# EAGLE design Board_V02 (EAGLE 9.3.0)
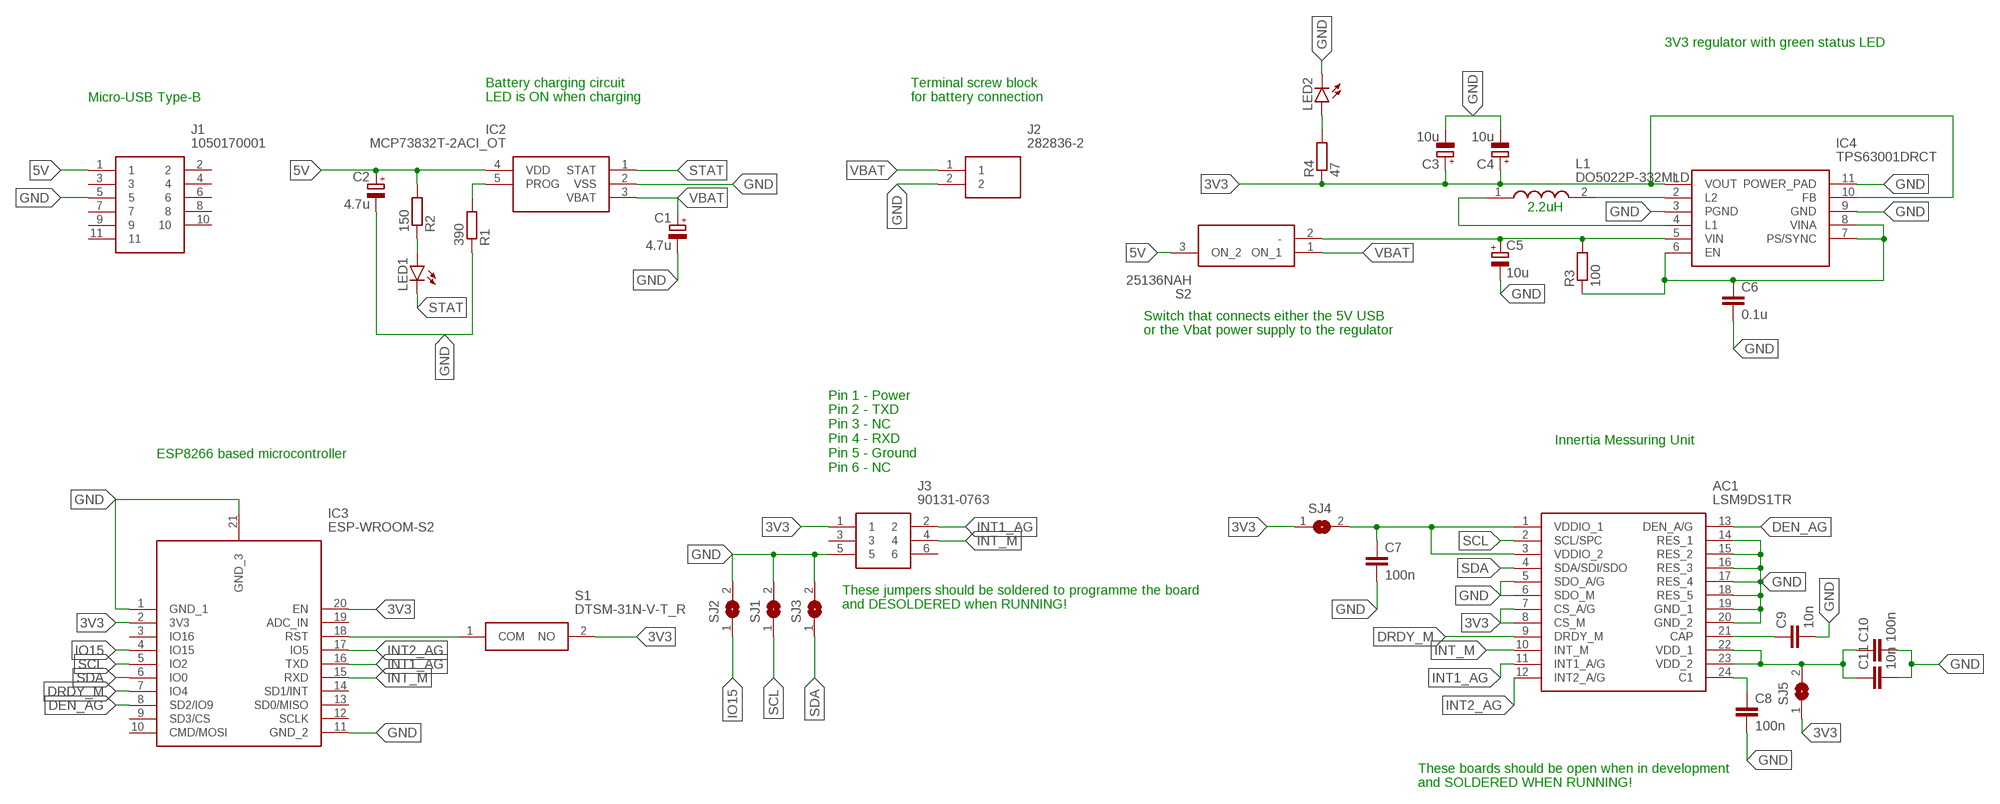
[diagram p0: schematic, sheet 1]

## Parts
AC1  LSM9DS1TR  [LGA-24L(3X3.5X1MM)]
C1  4.7u  CPOL-EUD/7343-31R  [D/7343-31R]
C2  4.7u  CPOL-EUD/7343-31R  [D/7343-31R]
C3  10u  CPOL-EUD/7343-31R  [D/7343-31R]
C4  10u  CPOL-EUD/7343-31R  [D/7343-31R]
C5  10u  CPOL-EUD/7343-31R  [D/7343-31R]
C6  0.1u  C-EUC0402  [C0402]
C7  100n  C-EUC0805  [C0805]
C8  100n  C-EUC0805  [C0805]
C9  10n  C-EUC0805  [C0805]
C10  100n  C-EUC0805  [C0805]
C11  10n  C-EUC0805  [C0805]
IC2  MCP73832T-2ACI_OT  [SOT95P270X145-5N]
IC3  ESP-WROOM-S2  [QFN150P1600X1700X315-21N]
IC4  TPS63001DRCT  [SON50P300X300X100-11N]
J1  1050170001  [MICROUSB-BTYPE]
J2  282836-2  [SHDR2W100P0X500_1X2_1000X820X1]
J3  90131-0763  [HDRV6W90P254_2X3_762X500X560P]
L1  DO5022P-332MLD  [DO5022P-104MLD]
LED1  LED5MM  [LED5MM]
LED2  LED5MM  [LED5MM]
R1  390  R-EU_R0805  [R0805]
R2  150  R-EU_R0805  [R0805]
R3  100  R-EU_R0805  [R0805]
R4  47  R-EU_R0805  [R0805]
S1  DTSM-31N-V-T_R  [DTSM32NVTR]
S2  25136NAH  [25136NAH]
SJ1  SJW  [SJW]
SJ2  SJW  [SJW]
SJ3  SJW  [SJW]
SJ4  SJW  [SJW]
SJ5  SJW  [SJW]

## Nets
3V3 [power]: AC1.7(CS_A/G) AC1.8(CS_M) C3.+ C4.+ IC3.2(3V3) IC3.20(EN) IC4.1(VOUT) IC4.10(FB) J3.1 R4.1 S1.2(NO) SJ4.1 SJ5.1
5V [power]: C2.+ IC2.4(VDD) J1.1 R2.2 S2.3(ON_2)
DEN_AG: AC1.13(DEN_A/G) IC3.8(SD2/IO9)
DRDY_M: AC1.9(DRDY_M) IC3.7(IO4)
GND [ground]: AC1.5(SDO_A/G) AC1.6(SDO_M) AC1.14(RES_1) AC1.15(RES_2) AC1.16(RES_3) AC1.17(RES_4) AC1.18(RES_5) AC1.19(GND_1) AC1.20(GND_2) C1.- C2.- C3.- C4.- C5.- C6.2 C7.2 C8.2 C9.2 C10.2 C11.2 IC2.2(VSS) IC3.1(GND_1) IC3.11(GND_2) IC3.21(GND_3) IC4.3(PGND) IC4.9(GND) IC4.11(POWER_PAD) J1.5 J2.2 J3.5 LED2.K(C) R1.1 SJ1.2 SJ2.2 SJ3.2
INT1_AG: AC1.11(INT1_A/G) IC3.16(TXD) J3.2
INT2_AG: AC1.12(INT2_A/G) IC3.17(IO5)
INT_M: AC1.10(INT_M) IC3.15(RXD) J3.4
IO15: IC3.4(IO15) SJ2.1
N$1: IC2.5(PROG) R1.2
N$2: LED1.A R2.1
N$3: AC1.21(CAP) C9.1
N$4: C5.+ IC4.5(VIN) R3.2 S2.2(-)
N$5: LED2.A R4.2
N$6: AC1.1(VDDIO_1) AC1.3(VDDIO_2) C7.1 SJ4.2
N$7: IC4.2(L2) L1.2
N$8: IC4.4(L1) L1.1
N$9: AC1.22(VDD_1) AC1.23(VDD_2) C10.1 C11.1 SJ5.2
N$10: C6.1 IC4.6(EN) IC4.7(PS/SYNC) IC4.8(VINA) R3.1
N$11: AC1.24(C1) C8.1
N$12: IC3.18(RST) S1.1(COM)
SCL: AC1.2(SCL/SPC) IC3.5(IO2) SJ1.1
SDA: AC1.4(SDA/SDI/SDO) IC3.6(IO0) SJ3.1
STAT: IC2.1(STAT) LED1.K(C)
VBAT: C1.+ IC2.3(VBAT) J2.1 S2.1(ON_1)
Unconnected: IC3.3(IO16) IC3.9(SD3/CS) IC3.10(CMD/MOSI) IC3.12(SCLK) IC3.13(SD0/MISO) IC3.14(SD1/INT) IC3.19(ADC_IN) J1.2 J1.3 J1.4 J1.6 J1.7 J1.8 J1.9 J1.10 J1.11 J3.3 J3.6

## Notes on the sheet
- 3V3 regulator with green status LED
- Micro-USB Type-B
- Battery charging circuit
  LED is ON when charging
- Terminal screw block 
  for battery connection
- 2.2uH
- Switch that connects either the 5V USB
  or the Vbat power supply to the regulator
- Innertia Messuring Unit
- ESP8266 based microcontroller
- Pin 1 - Power
  Pin 2 - TXD
  Pin 3 - NC
  Pin 4 - RXD
  Pin 5 - Ground
  Pin 6 - NC
- These jumpers should be soldered to programme the board
  and DESOLDERED when RUNNING!
- These boards should be open when in development
  and SOLDERED WHEN RUNNING!

## Library data of the parts
AC1 = SamacSys_Parts:LSM9DS1TR: iNEMO Inertial 3D Accel/Gyro/Magn. LGA24 STMicroelectronics LSM9DS1TR 3-Axis Accelerometer, Gyroscope & Magnetometer, 0 400 kHz, 1.9 3.6 V Source: Datasheet <http://www.st.com/content/ccc/resource/technical/document/datasheet/1e/3f/2a/d6/25/eb/48/46/DM00103319.pdf/files/DM00103319.pdf/jcr:content/translations/en.DM00103319.pdf>; DESCRIPTION: iNEMO Inertial 3D Accel/Gyro/Magn. LGA24 STMicroelectronics LSM9DS1TR 3-Axis Accelerometer, Gyroscope & Magnetometer, 0 400 kHz, 1.9 3.6 V; HEIGHT: mm; MANUFACTURER_NAME: STMicroelectronics; MANUFACTURER_PART_NUMBER: LSM9DS1TR; MOUSER_PART_NUMBER: 511-LSM9DS1TR; MOUSER_PRICE-STOCK: https://www.mouser.com/Search/Refine.aspx?Keyword=511-LSM9DS1TR; RS_PART_NUMBER: 1660908; RS_PRICE-STOCK: http://uk.rs-online.com/web/p/products/1660908
C1-C5 = rcl:CPOL-EU: POLARIZED CAPACITOR, European symbol; SPICEPREFIX: C
C6-C11 = rcl:C-EU: CAPACITOR, European symbol; SPICEPREFIX: C
IC2 = SamacSys_Parts:MCP73832T-2ACI_OT: Battery Charger Lithium-Ion, Lithium-Polymer Source: Datasheet <http://docs-emea.rs-online.com/webdocs/1381/0900766b81381752.pdf>; ALLIED_NUMBER: 70046199; ALLIED_PRICE-STOCK: http://www.alliedelec.com/microchip-technology-inc-mcp73832t-2aci-ot/70046199/; DESCRIPTION: Battery Charger Lithium-Ion, Lithium-Polymer; HEIGHT: 1.45mm; MANUFACTURER_NAME: Microchip; MANUFACTURER_PART_NUMBER: MCP73832T-2ACI/OT; MOUSER_PART_NUMBER: 579-MCP73832T-2ACIOT; MOUSER_PRICE-STOCK: https://www.mouser.com/Search/Refine.aspx?Keyword=579-MCP73832T-2ACIOT; RS_PART_NUMBER: 9122897; RS_PRICE-STOCK: http://uk.rs-online.com/web/p/products/9122897
IC3 = SamacSys_Parts:ESP-WROOM-S2: WiFi Modules (802.11) ESP-WROOM-S2, SMD Module, ESP8266EX, 16Mbits SPI Flash, SPI Mode Source: Datasheet <https://docs-emea.rs-online.com/webdocs/15b7/0900766b815b7223.pdf>; DESCRIPTION: WiFi Modules (802.11) ESP-WROOM-S2, SMD Module, ESP8266EX, 16Mbits SPI Flash, SPI Mode; HEIGHT: 3.15mm; MANUFACTURER_NAME: Espressif Systems; MANUFACTURER_PART_NUMBER: ESP-WROOM-S2
IC4 = SamacSys_Parts:TPS63001DRCT: 96% Buck-Boost Converter with 1.7A Current Switches, 3.3V fixed Output voltage in 3x3 QFN Source: Datasheet <http://uk.rs-online.com/web/p/products/7968405>; DESCRIPTION: 96% Buck-Boost Converter with 1.7A Current Switches, 3.3V fixed Output voltage in 3x3 QFN; HEIGHT: mm; MANUFACTURER_NAME: Texas Instruments; MANUFACTURER_PART_NUMBER: TPS63001DRCT; RS_PART_NUMBER: 7968405
J1 = SamacSys_Parts:1050170001: USB Connectors MICRO USB B REC RA SMT BOT Source: Datasheet <http://www.mouser.com/ds/2/276/1050170001_IO_CONNECTORS-230168.pdf>; DESCRIPTION: USB Connectors MICRO USB B REC RA SMT BOT; HEIGHT: mm; MANUFACTURER_NAME: Molex; MANUFACTURER_PART_NUMBER: 1050170001; MOUSER_PART_NUMBER: N/A; MOUSER_PRICE-STOCK: https://www.mouser.com/Search/Refine.aspx?Keyword=N%2FA
J2 = SamacSys_Parts:282836-2: TERMINAL BLOCK, PCB MOUNT, SIDE WIRE ENTRY, STACKING , 5.00mm PITCH Source: Datasheet <http://www.te.com/commerce/DocumentDelivery/DDEController?Action=srchrtrv&DocNm=282836&DocType=Customer Drawing&DocLang=English>; ALLIED_NUMBER: 70086275; ALLIED_PRICE-STOCK: https://www.alliedelec.com/te-connectivity-282836-2/70086275/; DESCRIPTION: TERMINAL BLOCK, PCB MOUNT, SIDE WIRE ENTRY, STACKING , 5.00mm PITCH; HEIGHT: 10.2mm; MANUFACTURER_NAME: TE Connectivity; MANUFACTURER_PART_NUMBER: 282836-2; MOUSER_PART_NUMBER: 571-2828362; MOUSER_PRICE-STOCK: https://www.mouser.com/Search/Refine.aspx?Keyword=571-2828362; RS_PART_NUMBER: 1354983; RS_PRICE-STOCK: http://uk.rs-online.com/web/p/products/1354983
J3 = SamacSys_Parts:90131-0763: Molex C-GRID III 90131, 2.54mm Pitch, 6 Way, 2 Row, Straight Pin Header, Through Hole Source: Datasheet <https://www.molex.com/pdm_docs/sd/901310763_sd.pdf>; ALLIED_NUMBER: 70372847; ALLIED_PRICE-STOCK: https://www.alliedelec.com/molex-incorporated-90131-0763/70372847/; DESCRIPTION: Molex C-GRID III 90131, 2.54mm Pitch, 6 Way, 2 Row, Straight Pin Header, Through Hole; HEIGHT: 5.6mm; MANUFACTURER_NAME: Molex; MANUFACTURER_PART_NUMBER: 90131-0763; MOUSER_PART_NUMBER: 538-90131-0763; MOUSER_PRICE-STOCK: https://www.mouser.com/Search/Refine.aspx?Keyword=538-90131-0763; RS_PART_NUMBER: 3606443P; RS_PRICE-STOCK: http://uk.rs-online.com/web/p/products/3606443P
L1 = SamacSys_Parts:DO5022P-332MLD: Fixed Inductors DO5022P Pwr Inductor 3.3 uH 20 % 6.2 A Source: Datasheet <https://www.coilcraft.com/pdfs/do5022p.pdf>; DESCRIPTION: Fixed Inductors DO5022P Pwr Inductor 3.3 uH 20 % 6.2 A; HEIGHT: mm; MANUFACTURER_NAME: COILCRAFT; MANUFACTURER_PART_NUMBER: DO5022P-332MLD; MOUSER_PART_NUMBER: 994-DO5022P-332MLD; MOUSER_PRICE-STOCK: https://www.mouser.com/Search/Refine.aspx?Keyword=994-DO5022P-332MLD
LED1 LED2 = led:LED: LED OSRAM: - CHIPLED LG R971, LG N971, LY N971, LG Q971, LY Q971, LO R971, LY R971 LH N974, LH R974 LS Q976, LO Q976, LY Q976 LO Q996 - Hyper CHIPLED LW Q18S LB Q993, LB Q99A, LB R99A - SideLED LS A670, LO A670, LY A670, LG A670, LP A670 LB A673, LV A673, LT A673, LW A673 LH A674 LY A675 LS A676, LA A676, LO A676, LY A676, LW A676 LS A679, LY A679, LG A679 - Hyper Micro SIDELED® LS Y876, LA Y876, LO Y876, LY Y876 LT Y87S - SmartLED LW L88C, LW L88S LB L89C, LB L89S, LG L890 LS L89K, LO L89K, LY L89K LS L896, LA L896, LO L896, LY L896 - TOPLED LS T670, LO T670, LY T670, LG T670, LP T670 LSG T670, LSP T670, LSY T670, LOP T670, LYG T670 LG T671, LOG T671, LSG T671 LB T673, LV T673, LT T673, LW T673 LH T674 LS T676, LA T676, LO T676, LY T676, LB T676, LH T676, LSB T676, LW T676 LB T67C, LV T67C, LT T67C, LS T67K, LO T67K, LY T67K, LW E67C LS E67B, LA E67B, LO E67B, LY E67B, LB E67C, LV E67C, LT E67C LW T67C LS T679, LY T679, LG T679 LS T770, LO T770, LY T770, LG T770, LP T770 LB T773, LV T773, LT T773, LW T773 LH T774 LS E675, LA E675, LY E675, LS T675 LS T776, LA T776, LO T776, LY T776, LB T776 LHGB T686 LT T68C, LB T68C - Hyper Mini TOPLED® LB M676 - Mini TOPLED Santana® LG M470 LS M47K, LO M47K, LY M47K Source: http://www.osram.convergy.de LUXEON: - LUMILED® LXK2-PW12-R00, LXK2-PW12-S00, LXK2-PW14-U00, LXK2-PW14-V00 LXK2-PM12-R00, LXK2-PM12-S00, LXK2-PM14-U00 LXK2-PE12-Q00, LXK2-PE12-R00, LXK2-PE12-S00, LXK2-PE14-T00, LXK2-PE14-U00 LXK2-PB12-K00, LXK2-PB12-L00, LXK2-PB12-M00, LXK2-PB14-N00, LXK2-PB14-P00, LXK2-PB14-Q00 LXK2-PR12-L00, LXK2-PR12-M00, LXK2-PR14-Q00, LXK2-PR14-R00 LXK2-PD12-Q00, LXK2-PD12-R00, LXK2-PD12-S00 LXK2-PH12-R00, LXK2-PH12-S00 LXK2-PL12-P00, LXK2-PL12-Q00, LXK2-PL12-R00 Source: www.luxeon.com KINGBRIGHT: KA-3528ASYC Source: www.kingbright.com
R1-R4 = rcl:R-EU_: RESISTOR, European symbol; SPICEPREFIX: R
S1 = SamacSys_Parts:DTSM-31N-V-T_R: Tactile Switches SMT Type 3.5*6 Source: Datasheet <http://www.dip.com.tw/en/en-product-information/en-switch004/item/2444-dts-3-dtsm-l-3>; DESCRIPTION: Tactile Switches SMT Type 3.5*6; HEIGHT: 5mm; MANUFACTURER_NAME: Diptronics; MANUFACTURER_PART_NUMBER: DTSM-31N-V-T/R; MOUSER_PART_NUMBER: 113-DTSM31NVTR; MOUSER_PRICE-STOCK: https://www.mouser.com/Search/Refine.aspx?Keyword=113-DTSM31NVTR
S2 = SamacSys_Parts:25136NAH: PCB Slide Switch SPDT On-On 4 A@ 125 V ac Slide Source: Datasheet <https://www.apem.com/int/index.php?controller=attachment&id_attachment=858>; DESCRIPTION: PCB Slide Switch SPDT On-On 4 A@ 125 V ac Slide; HEIGHT: 8mm; MANUFACTURER_NAME: Apem; MANUFACTURER_PART_NUMBER: 25136NAH; MOUSER_PART_NUMBER: 642-25136NAH; MOUSER_PRICE-STOCK: https://www.mouser.com/Search/Refine.aspx?Keyword=642-25136NAH; RS_PART_NUMBER: 0339673A; RS_PRICE-STOCK: http://uk.rs-online.com/web/p/products/0339673A
SJ1-SJ5 = jumper:SJ: SMD solder JUMPER

## Net classes
0 default: width 0.406 mm
1 ground: width 0.61 mm
2 power: width 0.508 mm

## Board
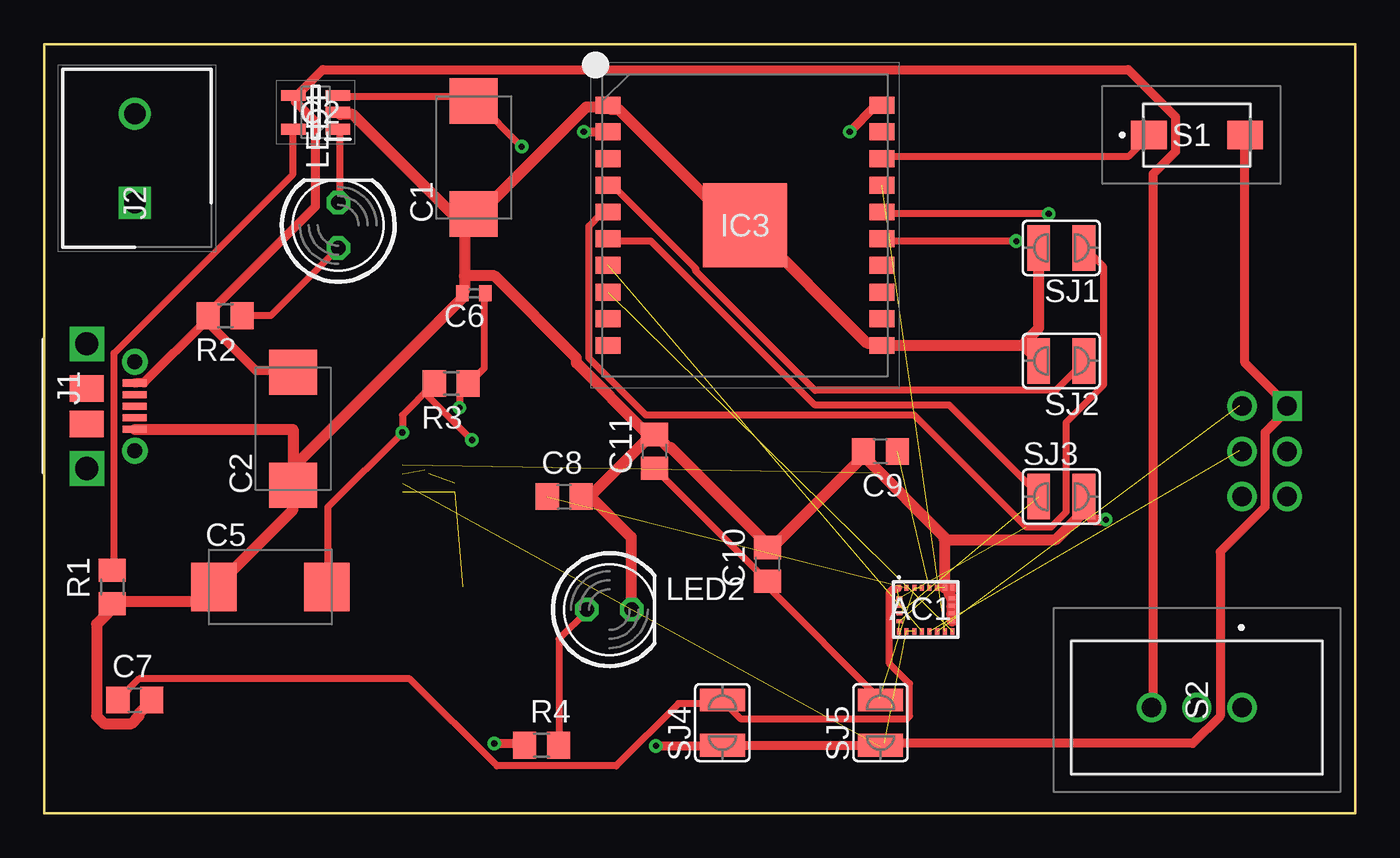
[diagram p1: board, top side]
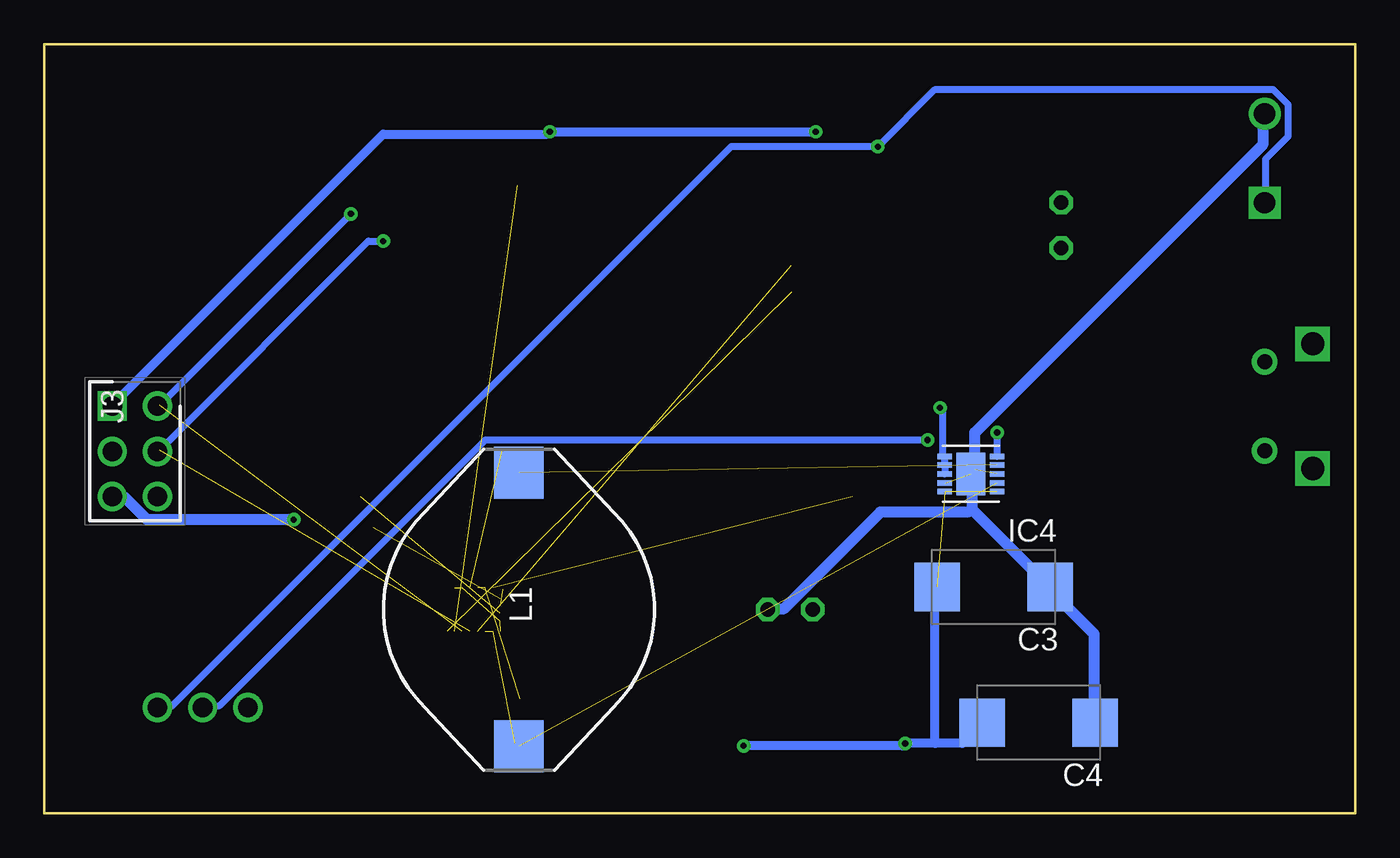
[diagram p2: board, bottom side, seen from below]

Size 73.66 x 43.18 mm. Coordinates in mm from the lower left corner, seen from the top.
Outline: 0,0 0,43.18 73.66,43.18 73.66,0 0,0
Copper layers (1*16): Top 0.035mm / dielectric 1.5mm / Bottom 0.035mm
Design rules "default": minimum track width 6mil, minimum drill 0.35mm, track to track 6mil, track to pad 6mil, pad to pad 6mil, via to via 6mil, smd to smd 6mil, copper to edge 40mil, drill to drill 6mil, minimum pad ring 10mil, minimum via ring 8mil, stop-mask expansion 4mil, vias tented up to drill 0mil, thermal gap 10mil

### Footprints (pad centres in the part's own frame; a part is rotated, then mirrored left to right if it is on the bottom)
LGA-24L(3X3.5X1MM) = smd 0.23 x 0.35: 1 -1.505,1.225; 6 -1.505,-1.225; 7 -1.075,-1.225; 8 -0.645,-1.225; 9 -0.215,-1.225; 10 0.215,-1.225; 11 0.645,-1.225; 12 1.075,-1.225; 13 1.505,-1.225; 18 1.505,1.225; 19 1.075,1.225; 20 0.645,1.225; 21 0.215,1.225; 22 -0.215,1.225; 23 -0.645,1.225; 24 -1.075,1.225 | smd 0.35 x 0.23: 2 -1.475,0.645; 3 -1.475,0.215; 4 -1.475,-0.215; 5 -1.475,-0.645; 14 1.475,-0.645; 15 1.475,-0.215; 16 1.475,0.215; 17 1.475,0.645
D/7343-31R = smd 2.55 x 2.7: + 3.175,0; - -3.175,0
C0402 = smd 0.7 x 0.9: 1 -0.65,0; 2 0.65,0
C0805 = smd 1.3 x 1.5: 1 -0.95,0; 2 0.95,0
SOT95P270X145-5N = smd 1.4 x 0.6: 1 -1.25,0.95; 2 -1.25,0; 3 -1.25,-0.95; 4 1.25,-0.95; 5 1.25,0.95
QFN150P1600X1700X315-21N = smd 1.4 x 0.95: 1 -7.7,6.75; 2 -7.7,5.25; 3 -7.7,3.75; 4 -7.7,2.25; 5 -7.7,0.75; 6 -7.7,-0.75; 7 -7.7,-2.25; 8 -7.7,-3.75; 9 -7.7,-5.25; 10 -7.7,-6.75; 11 7.7,-6.75; 12 7.7,-5.25; 13 7.7,-3.75; 14 7.7,-2.25; 15 7.7,-0.75; 16 7.7,0.75; 17 7.7,2.25; 18 7.7,3.75; 19 7.7,5.25; 20 7.7,6.75 | smd 4.7 x 4.7: 21 0,0
SON50P300X300X100-11N = smd 0.813 x 0.305: 1 -1.473,0.991; 2 -1.473,0.508; 3 -1.473,0; 4 -1.473,-0.508; 5 -1.473,-0.991; 6 1.473,-0.991; 7 1.473,-0.508; 8 1.473,0; 9 1.473,0.508; 10 1.473,0.991 | smd 1.651 x 2.388: 11 0,0
MICROUSB-BTYPE = smd 0.4 x 1.35: 1 -1.3,0; 2 -0.65,0; 3 0,0; 4 0.65,0; 5 1.3,0 | drill 0.85 pad 1.45: 6 -2.5,0; 7 2.5,0 | drill 1.3 pad 1.9 square: 8 -3.5,-2.7; 9 3.5,-2.7 | smd 1.5 x 1.9: 10 -1,-2.7; 11 1,-2.7
SHDR2W100P0X500_1X2_1000X820X1 = drill 1.2 pad 1.8 square: 1 0,0 | drill 1.2 pad 1.8: 2 5,0
HDRV6W90P254_2X3_762X500X560P = drill 1.1 pad 1.65 square: 1 0,0 | drill 1.1 pad 1.65: 2 0,2.54; 3 2.54,0; 4 2.54,2.54; 5 5.08,0; 6 5.08,2.54
DO5022P-104MLD = smd 2.92 x 2.79: 1 -7.685,0; 2 7.685,0
LED5MM = drill 0.813 octagon: A -1.27,0; K 1.27,0
R0805 = smd 1.3 x 1.5: 1 -0.95,0; 2 0.95,0
DTSM32NVTR = smd 2 x 1.6: 1 -2.7,0; 2 2.7,0
25136NAH = drill 1.1 pad 1.65: 1 -0.425,-2.54; 2 -0.425,0; 3 -0.425,2.54
SJW = smd 1.27 x 2.54: 1 -1.27,0; 2 1.27,0

### Placement (x,y rotation side)
AC1  49.53,11.43 0 top
C1  24.13,36.83 90 top
C2  13.97,21.59 90 top
C3  20.32,12.7 180 bottom
C4  17.78,5.08 180 bottom
C5  12.7,12.7 0 top
C6  24.13,29.21 180 top
C7  5.08,6.35 0 top
C8  29.21,17.78 0 top
C9  46.99,20.32 180 top
C10  40.64,13.97 90 top
C11  34.29,20.32 90 top
IC2  15.24,39.37 180 top
IC3  39.37,33.02 0 top
IC4  21.59,19.05 180 bottom
J1  5.08,22.86 270 top
J2  5.08,34.29 90 top
J3  69.85,22.86 270 bottom
L1  46.99,11.43 270 bottom
LED1  16.51,33.02 90 top
LED2  31.75,11.43 0 top
R1  3.81,12.7 90 top
R2  10.16,27.94 180 top
R3  22.86,24.13 180 top
R4  27.94,3.81 0 top
S1  64.77,38.1 0 top
S2  64.77,6.35 90 top
SJ1  57.15,31.75 180 top
SJ2  57.15,25.4 180 top
SJ3  57.15,17.78 0 top
SJ4  38.1,5.08 90 top
SJ5  46.99,5.08 90 top

### Tracks (layer width: path | path; a pad name or v marks a point on that pad's centre or on a via)
3V3  (via drill 0.35)  (4 unrouted)
  Top 0.508: v25.29,3.91 26.96,3.91 R4.1 | v34.37,3.77 37.86,3.77 SJ4.1 38.14,3.77 46.94,3.77 SJ5.1 47.22,3.91 64.54,3.91 66.08,5.45 66.08,14.67 68.59,17.18 68.59,21.37 69.85,22.63 J3.1 69.85,22.91 67.47,25.29 67.47,38 S1.2 | v30.32,38.28 31.57,38.28 IC3.2 | v45.26,38.28 46.66,39.67 46.94,39.67 IC3.20
  Bottom 0.508: 23.61,3.91 22.07,3.91 20.95,5.03 C4.+ | 23.61,3.91 v25.29,3.91 25.43,3.77 v34.37,3.77 | 23.61,3.91 23.61,12.57 C3.+ | v30.32,38.28 v45.26,38.28 45.4,38.14 54.62,38.14 69.85,22.91 J3.1
5V
  Top 0.508: J1.1 5.17,24.17 5.59,24.17 9.08,27.66 9.08,27.94 R2.2 | R2.2 9.22,28.08 15.23,34.09 15.23,38.84 14.11,39.95 14.11,40.23 IC2.4 14.25,40.37 15.65,41.77 60.91,41.77 63.56,39.12 63.56,37.16 62.31,35.9 62.31,6.01 S2.3 | C2.+ 13.97,24.87 11.87,24.87 9.22,27.52 R2.2
DEN_AG  (1 unrouted)
DRDY_M  (1 unrouted)
GND  (via drill 0.35)  (5 unrouted)
  Top 0.61: C7.2 6.01,6.29 5.31,5.59 5.31,5.45 4.89,5.03 3.35,5.03 2.93,5.45 2.93,10.62 3.77,11.46 R1.1 3.91,11.87 8.8,11.87 9.5,12.57 C5.- 9.78,12.85 13.97,17.04 C2.- | 55.04,26.26 IC3.11 46.8,26.4 46.24,26.4 39.67,32.97 IC3.21 39.26,33.11 38.7,33.11 32.27,39.53 31.85,39.53 IC3.1 31.57,39.67 30.45,39.67 24.45,33.67 C1.- | 55.04,26.26 55.88,25.43 SJ2.2 | SJ1.2 55.88,27.24 55.18,26.54 55.04,26.26 | 23.61,30.18 23.61,33.11 24.03,33.53 C1.- | 23.61,30.18 23.61,29.34 C6.2 23.47,28.92 14.11,19.56 14.11,18.58 C2.- | IC2.2 16.62,39.26 17.32,39.26 23.33,33.25 C1.- | 30.73,17.88 30.18,17.88 C8.2 | 30.73,17.88 34.23,21.37 C11.2 | LED2.K 32.97,11.46 32.97,15.51 30.87,17.6 30.73,17.88 | 50.85,12.71 50.99,12.71 AC1.18 | 50.85,12.71 50.71,12.71 | 50.71,12.71 AC1.19 | 50.99,11.18 50.99,10.9 AC1.14 | 50.99,11.18 AC1.15 | 50.99,11.6 AC1.16 | 50.99,11.6 50.99,11.18 | 50.99,12.01 AC1.17 | 50.99,12.01 50.99,11.6 | 50.85,12.71 50.85,12.29 50.99,12.01 | 50.57,15.37 50.57,15.51 46.1,19.98 46.1,20.26 C9.2 45.82,19.84 40.93,14.95 40.65,14.95 C10.2 40.51,15.23 35.2,20.54 35.06,20.54 34.51,21.09 C11.2 | 50.57,15.37 50.57,12.99 50.71,12.71 | 50.57,15.37 56.86,15.37 58.4,16.9 58.4,17.74 SJ3.2 58.67,16.76 58.95,16.48 v59.65,16.48 | 23.61,30.18 25.29,30.18 29.9,25.57 29.9,25.29 33.81,21.37 C11.2 | J1.5 13.97,21.56 C2.-
  Bottom 0.61: v59.65,16.48 67.89,16.48 69.15,17.74 69.85,17.74 J3.5 | 21.51,17.04 21.51,19 IC4.11 21.37,19.28 21.37,21.37 5.17,37.58 5.17,39.26 J2.2 | 21.51,17.04 17.18,12.71 C3.- 17.04,12.43 14.67,10.06 14.67,5.17 C4.- | LED2.K 32.97,11.46 32.13,11.46 26.68,16.9 21.79,16.9 21.51,17.04
INT1_AG  (via drill 0.35)  (1 unrouted)
  Top 0.406: v56.44,33.67 47.08,33.67 IC3.16
  Bottom 0.406: v56.44,33.67 67.2,22.91 J3.2
INT2_AG  (1 unrouted)
INT_M  (via drill 0.35)  (1 unrouted)
  Top 0.406: v54.62,32.13 47.08,32.13 IC3.15
  Bottom 0.406: v54.62,32.13 55.46,32.13 67.2,20.4 J3.4
IO15
  Top 0.406: IC3.4 31.71,35.2 31.99,35.2 36.6,30.59 36.6,30.45 43.31,23.75 56.86,23.75 58.4,25.29 SJ2.1
N$1
  Top 0.406: IC2.5 13.97,38.42 13.97,35.9 3.91,25.84 3.91,13.69 R1.2
N$2
  Top 0.406: R2.1 12.71,27.94 16.48,31.71 LED1.A
N$3  (1 unrouted)
N$4  (via drill 0.35)
  Top 0.406: C5.+ 15.93,12.71 15.93,17.18 v20.12,21.37 20.12,22.35 21.79,24.03 R3.2 21.51,23.47 v24.03,20.95
  Bottom 0.406: v20.12,21.37 IC4.5 | v24.03,20.95 48.9,20.95 63.84,6.01 64.68,6.01 S2.2
N$5
  Top 0.406: R4.2 28.92,3.91 28.92,9.78 30.45,11.32 LED2.A
N$6  (1 unrouted)
  Top 0.406: AC1.1 47.92,12.57 47.64,12.57 47.5,12.43 47.5,8.38 48.62,7.26 48.62,5.45 48.48,5.31 39.12,5.31 38.14,6.29 SJ4.2 38,6.15 35.62,6.15 32.13,2.65 25.43,2.65 20.54,7.54 5.31,7.54 4.19,6.43 C7.1
N$7  (1 unrouted)
N$8  (1 unrouted)
N$9  (2 unrouted)
  Top 0.406: C11.1 34.37,19.28 40.51,13.13 C10.1 40.65,12.85 40.65,12.71 46.94,6.43 SJ5.2
N$10  (via drill 0.35)
  Top 0.406: C6.1 24.73,29.2 24.73,25.01 23.89,24.17 R3.1 23.75,24.03 23.33,23.61 v23.33,22.77
  Bottom 0.406: IC4.8 23.05,19.14 IC4.7 23.05,19.7 23.05,19.98 IC4.6 23.19,20.12 23.19,22.63 v23.33,22.77
N$11  (1 unrouted)
N$12
  Top 0.406: IC3.18 47.08,36.88 60.91,36.88 62.03,38 S1.1
SCL  (1 unrouted)
  Top 0.406: IC3.5 31.57,33.67 31.29,33.67 30.59,32.97 30.59,25.57 33.81,22.35 48.9,22.35 55.18,16.07 56.58,16.07 57.42,16.9 57.42,21.93 59.51,24.03 59.51,30.73 58.53,31.71 SJ1.1
SDA  (1 unrouted)
  Top 0.406: IC3.6 31.71,32.13 34.09,32.13 43.31,22.91 50.85,22.91 55.88,17.88 SJ3.1
STAT
  Top 0.406: IC2.1 16.62,38.42 16.62,34.37 LED1.K
VBAT  (via drill 0.35)
  Top 0.406: IC2.3 16.62,40.23 23.89,40.23 24.03,40.09 C1.+ 24.31,39.95 v26.82,37.44
  Bottom 0.406: S2.1 67.2,6.01 66.5,6.01 35.06,37.44 v26.82,37.44 23.61,40.65 4.61,40.65 3.77,39.81 3.77,38 5.03,36.74 5.03,34.37 J2.1